# EAGLE design pedal-v1.0 (EAGLE 8.0.0)
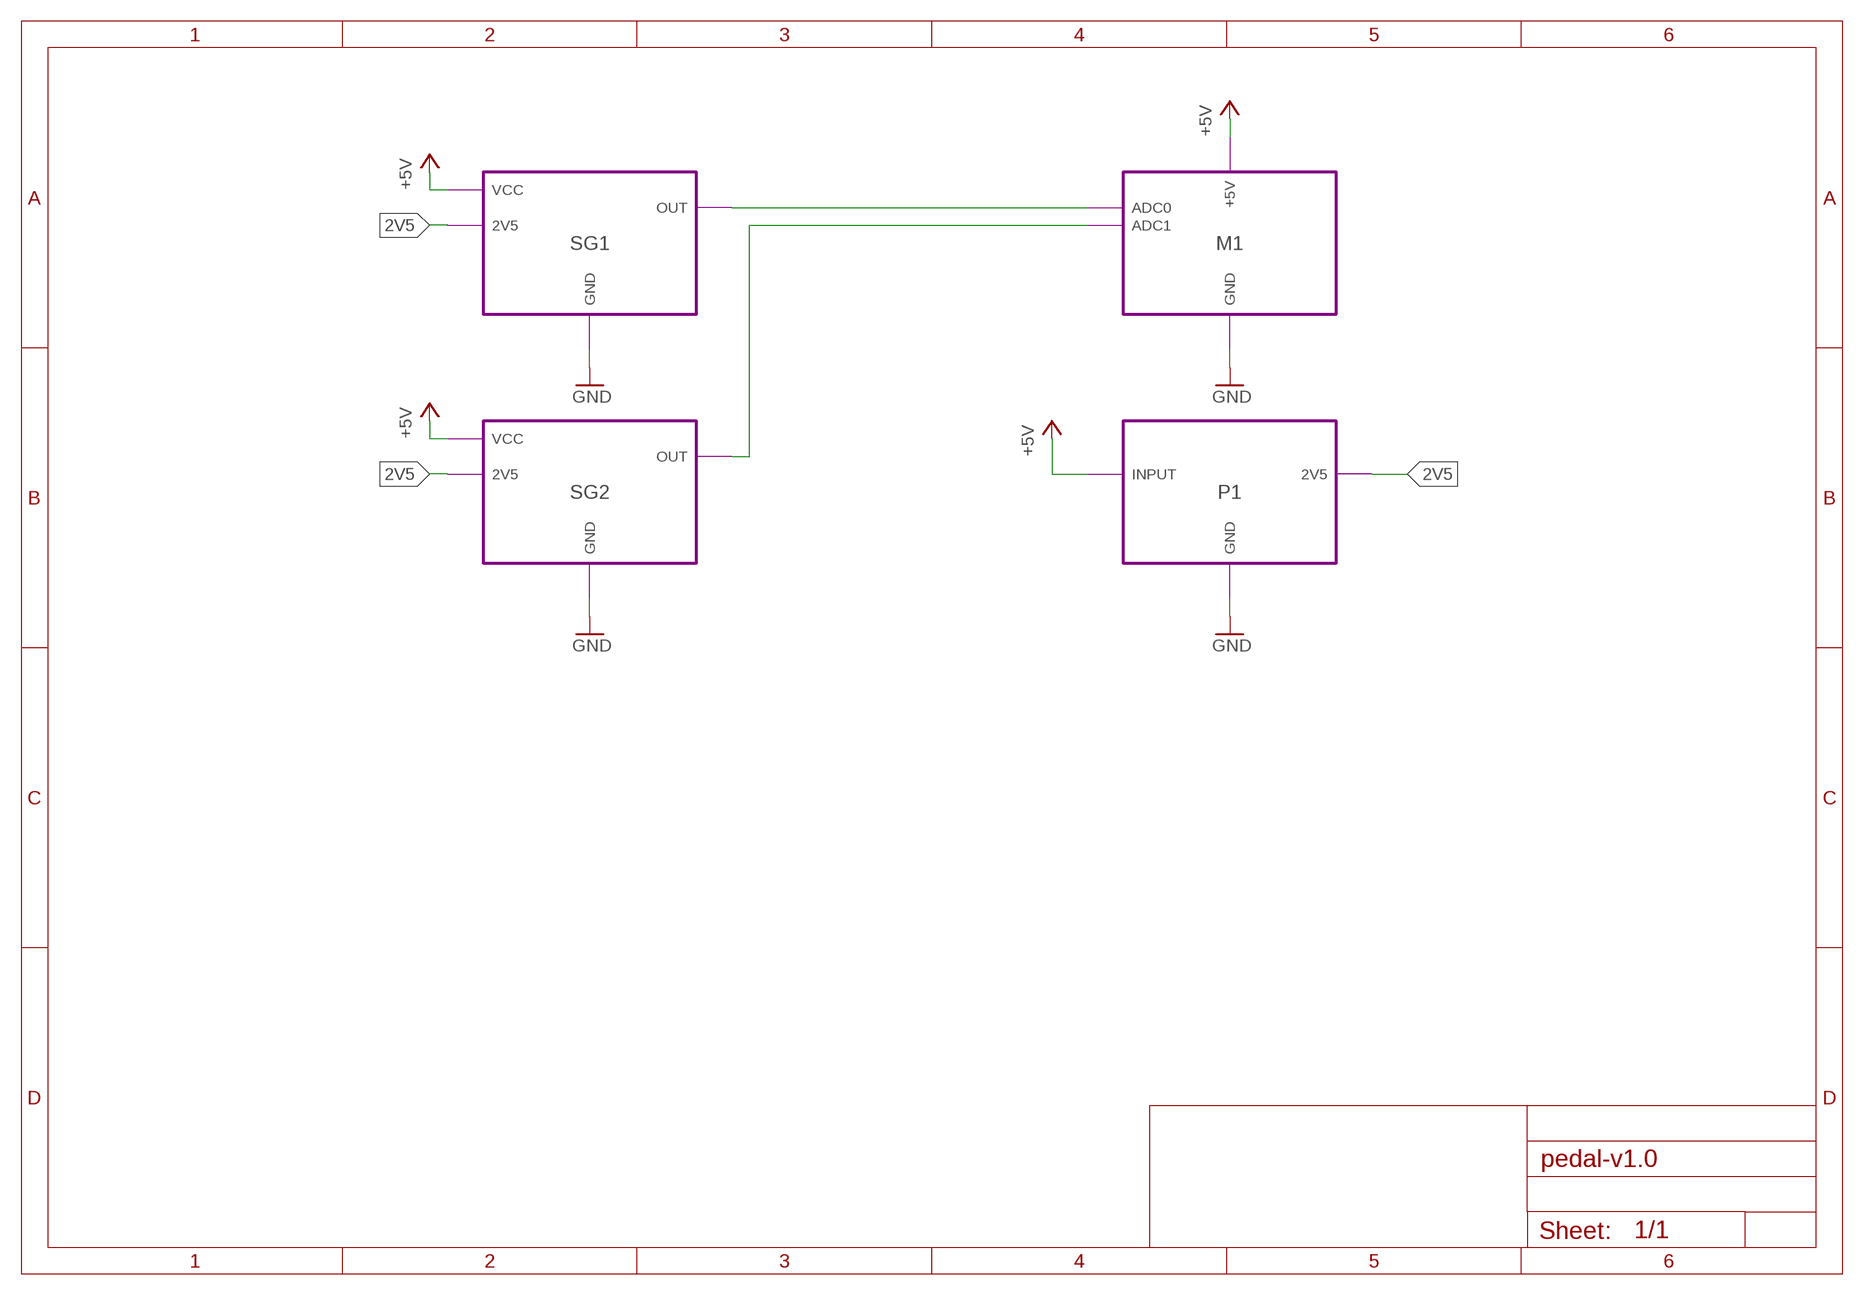
[diagram p0: schematic, sheet 1]

## Module instances
SG1 = STRAINGAUGE
SG2 = STRAINGAUGE
M1 = MCU
P1 = POWER

## Nets
2V5: port P1.2V5 SG1.2V5 SG2.2V5
+5V: port P1.INPUT M1.+5V SG1.VCC SG2.VCC
GND: port M1.GND P1.GND SG2.GND SG1.GND
N$1: port SG1.OUT M1.ADC0
N$2: port SG2.OUT M1.ADC1

## Library data of the parts

## Module STRAINGAUGE
Ports: OUT(io) 2V5(io) GND(io) VCC(io)
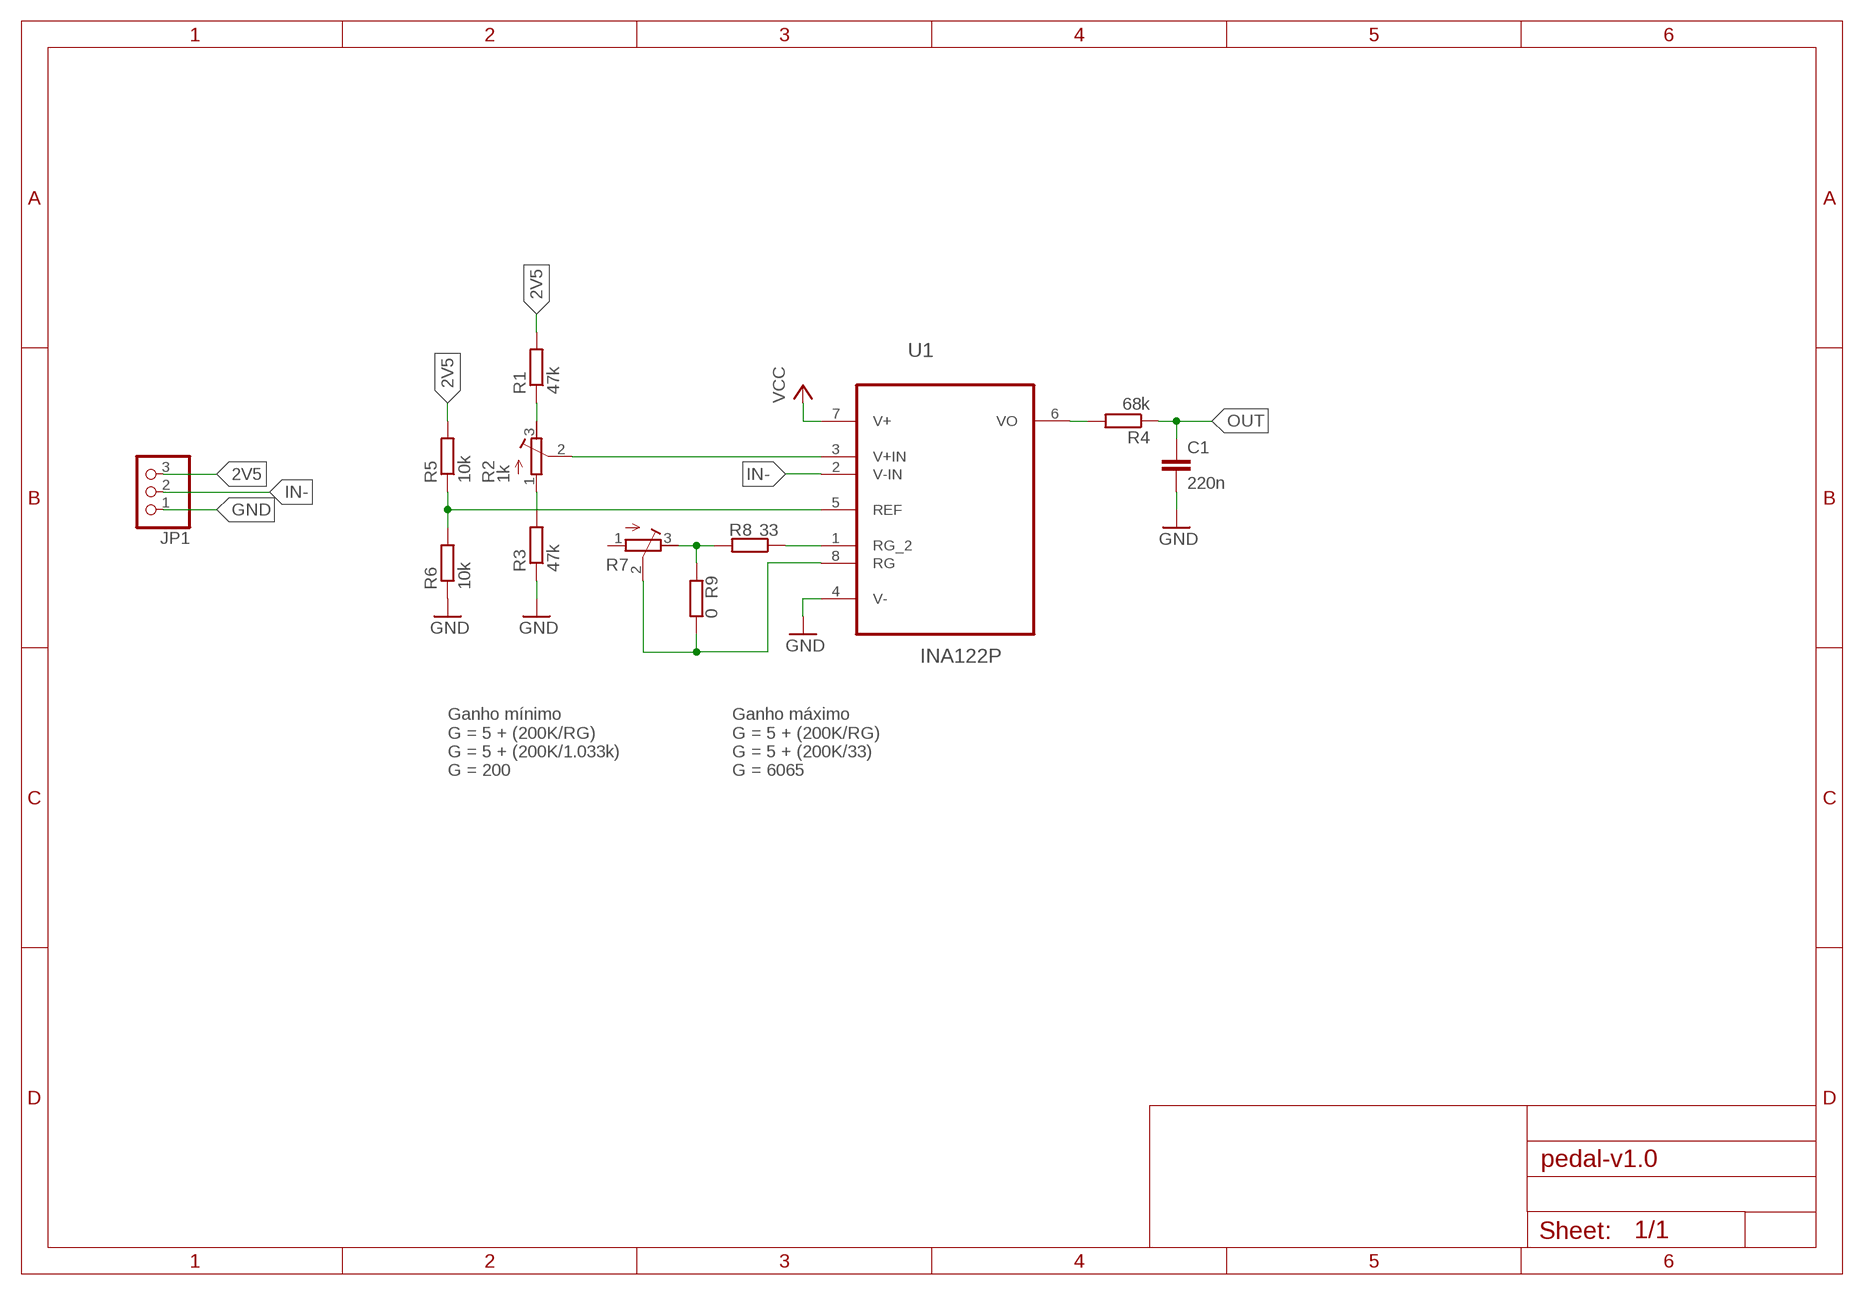
[diagram p1: schematic, module STRAINGAUGE, sheet 1]

### Parts
C1  220n  CPTH  [C050-030X075]
JP1  PINHD-1X3/90  [1X03/90]
R1  47k  RPTH  [0207/7]
R2  1k  R-TRIMM64W  [RTRIM64W]
R3  47k  RPTH  [0207/7]
R4  68k  RPTH  [0207/7]
R5  10k  RPTH  [0207/7]
R6  10k  RPTH  [0207/7]
R7  R-TRIMM64W  [RTRIM64W]
R8  33  RPTH  [0207/7]
R9  0  RPTH  [0207/7]
U1  INA122P  [DIP254P762X508-8]

### Nets
2V5: JP1.3 R1.2 R5.2
GND: C1.2 JP1.1 R3.1 R6.1 U1.4(V-)
IN-: JP1.2 U1.2(V-IN)
N$1: R1.1 R2.3(E)
N$2: R2.1(A) R3.2
N$3: R4.2 U1.6(VO)
N$5: R2.2(S) U1.3(V+IN)
N$6: R5.1 R6.2 U1.5(REF)
N$7: R8.1 U1.1(RG_2)
N$8: R7.3(E) R8.2 R9.2
N$9: R7.2(S) R9.1 U1.8(RG)
OUT: C1.1 R4.1
VCC: U1.7(V+)
Unconnected: R7.1(A)

### Notes on the sheet
- Ganho mínimo
  G = 5 + (200K/RG)
  G = 5 + (200K/1.033k)
  G = 200
- Ganho máximo
  G = 5 + (200K/RG)
  G = 5 + (200K/33)
  G = 6065

### Library data of the parts
C1 = lpra:C: Capacitors
JP1 = pinhead:PINHD-1X3: PIN HEADER
R1 R3-R6 R8 R9 = lpra:R
R2 R7 = rcl:R-TRIMM: Trimm resistor
U1 = lpra:INA122P: INSTRUMENTATION AMPLIFIER; MPN: INA122P; OC_FARNELL: 1459460; OC_NEWARK: 15M0948; PACKAGE: PDIP; SUPPLIER: Texas Instruments

## Module MCU
Ports: ADC0(io) ADC1(io) GND(io) +5V(io)
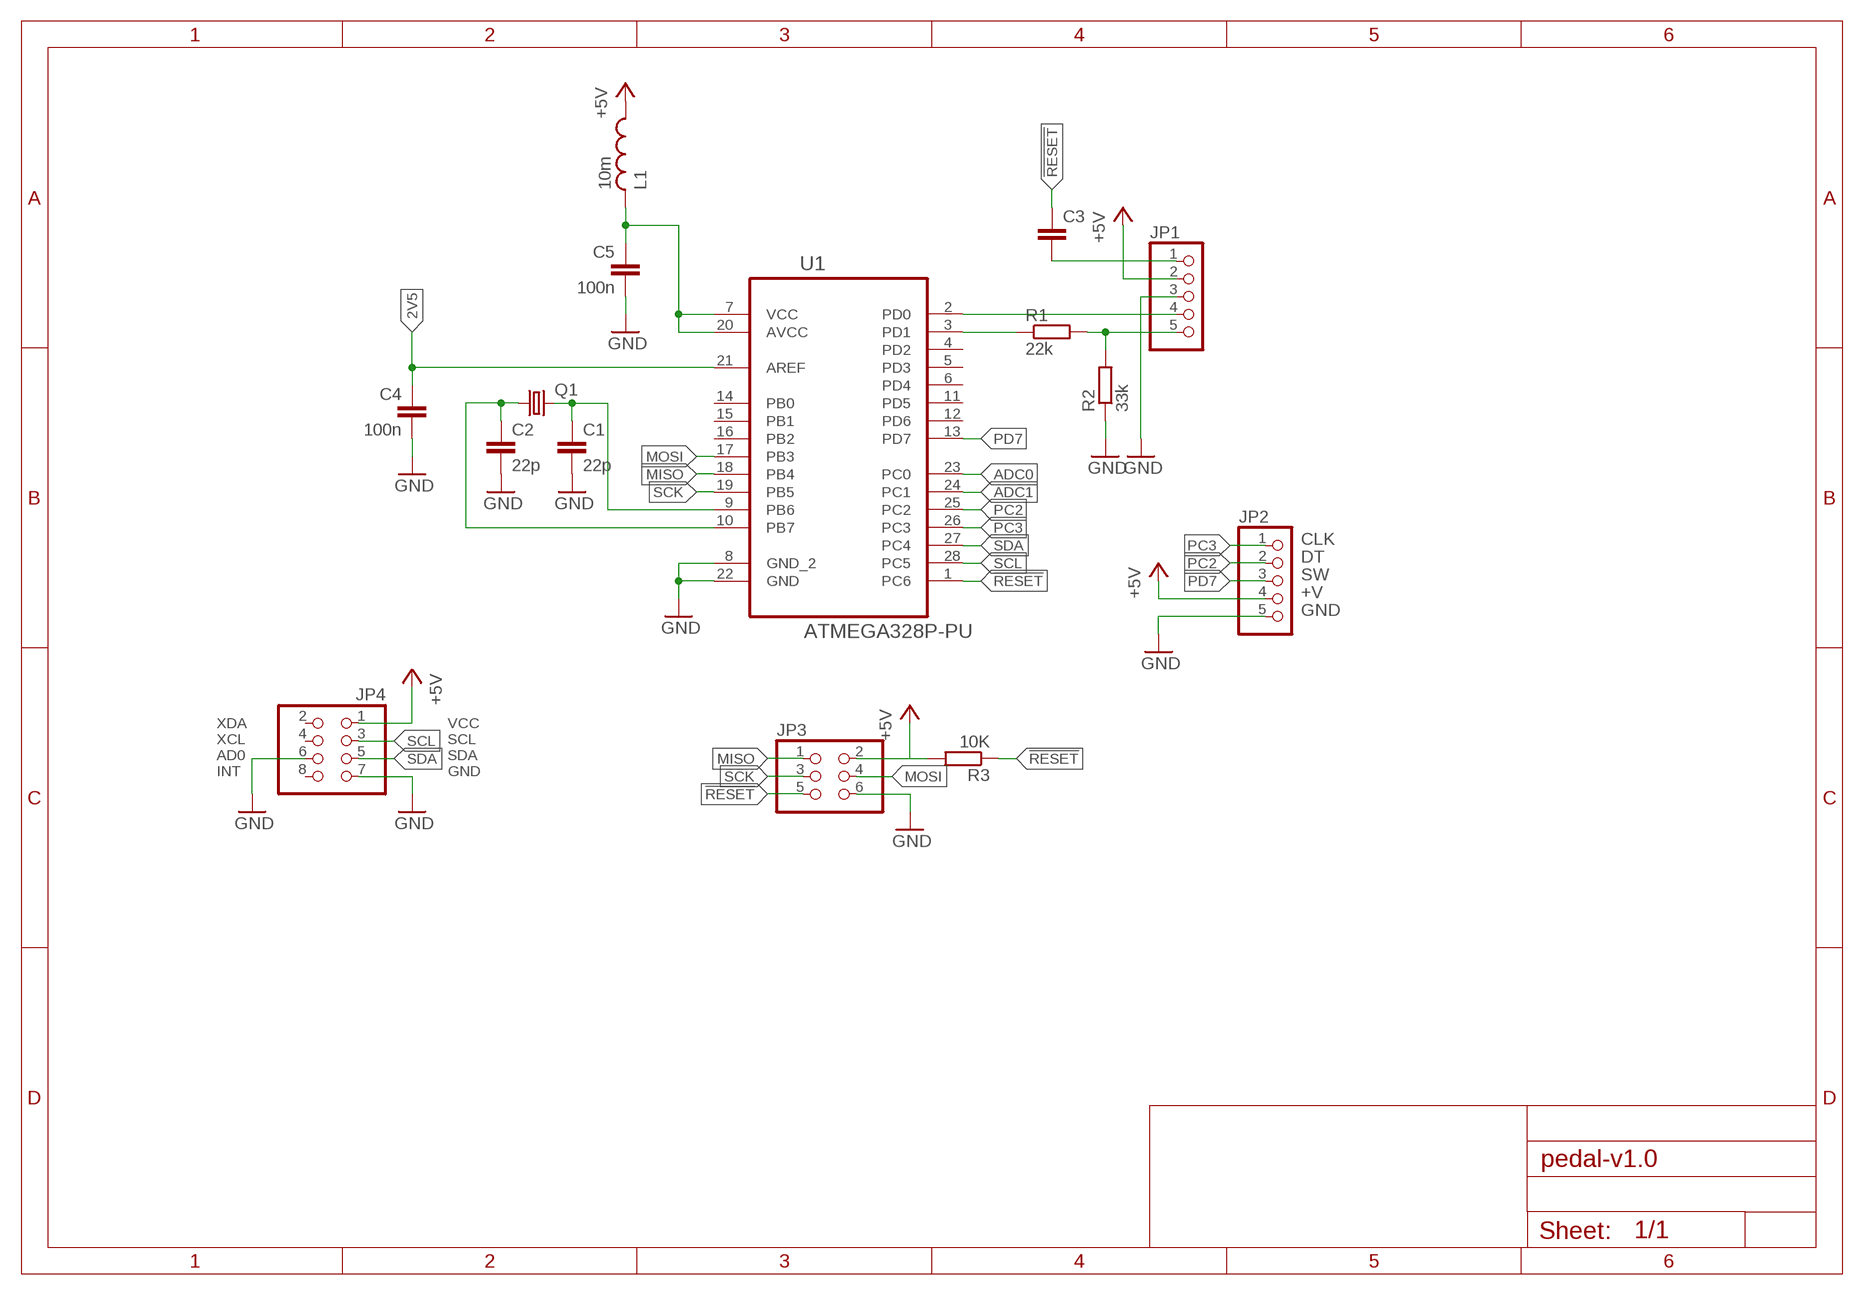
[diagram p2: schematic, module MCU, sheet 1]

### Parts
C1  22p  CPTH  [C050-030X075]
C2  22p  CPTH  [C050-030X075]
C3  CPTH  [C050-030X075]
C4  100n  CPTH  [C050-030X075]
C5  100n  CPTH  [C050-030X075]
JP1  PINHD-1X5  [1X05]
JP2  PINHD-1X5  [1X05]
JP3  PINHD-2X3  [2X03]
JP4  PINHD-2X4  [2X04]
L1  10m  L-US0207/7  [0207/7]
Q1  CRYSTALHC49S  [HC49/S]
R1  22k  RPTH  [0207/7]
R2  33k  RPTH  [0207/7]
R3  10K  RPTH  [0207/7]
U1  ATMEGA328P-PU  [DIP254P762X457-28]

### Nets
2V5: C4.1 U1.21(AREF)
!RESET: C3.1 JP3.5 R3.1 U1.1(PC6)
+5V: JP1.2 JP2.4 JP3.2 JP4.1 L1.1 R3.2
ADC0: U1.23(PC0)
ADC1: U1.24(PC1)
GND: C1.2 C2.2 C4.2 C5.2 JP1.3 JP2.5 JP3.6 JP4.6 JP4.7 R2.1 U1.8(GND_2) U1.22(GND)
MISO: JP3.1 U1.18(PB4)
MOSI: JP3.4 U1.17(PB3)
N$1: JP1.5 R1.2 R2.2
N$2: JP1.4 U1.2(PD0)
N$3: C1.1 Q1.2 U1.9(PB6)
N$4: C2.1 Q1.1 U1.10(PB7)
N$5: R1.1 U1.3(PD1)
N$6: C3.2 JP1.1
N$7: C5.1 L1.2 U1.7(VCC) U1.20(AVCC)
PC2: JP2.2 U1.25(PC2)
PC3: JP2.1 U1.26(PC3)
PD7: JP2.3 U1.13(PD7)
SCK: JP3.3 U1.19(PB5)
SCL: JP4.3 U1.28(PC5)
SDA: JP4.5 U1.27(PC4)
Unconnected: JP4.2 JP4.4 JP4.8 U1.4(PD2) U1.5(PD3) U1.6(PD4) U1.11(PD5) U1.12(PD6) U1.14(PB0) U1.15(PB1) U1.16(PB2)

### Notes on the sheet
- CLK
- DT
- SW
- +V
- GND
- XDA
  XCL
  AD0
  INT
- VCC
  SCL
  SDA
  GND

### Library data of the parts
C1-C5 = lpra:C: Capacitors
JP1 JP2 = pinhead:PINHD-1X5: PIN HEADER
JP3 = pinhead:PINHD-2X3: PIN HEADER
JP4 = pinhead:PINHD-2X4: PIN HEADER
L1 = rcl:L-US: INDUCTOR, American symbol
Q1 = crystal:CRYSTAL: CRYSTAL; OC_FARNELL: 1667008; OC_NEWARK: unknown
R1-R3 = lpra:R
U1 = Atmel_By_element14_Batch_1-00:ATMEGA328P-PU: 8-bit Microcontroller with In-System Programmable Flash; MPN: ATMEGA328P-PU; OC_FARNELL: 1715487; OC_NEWARK: 15R0268; PACKAGE: PDIP-28; SUPPLIER: Atmel

## Module POWER
Ports: GND(io) INPUT(io) 2V5(io)
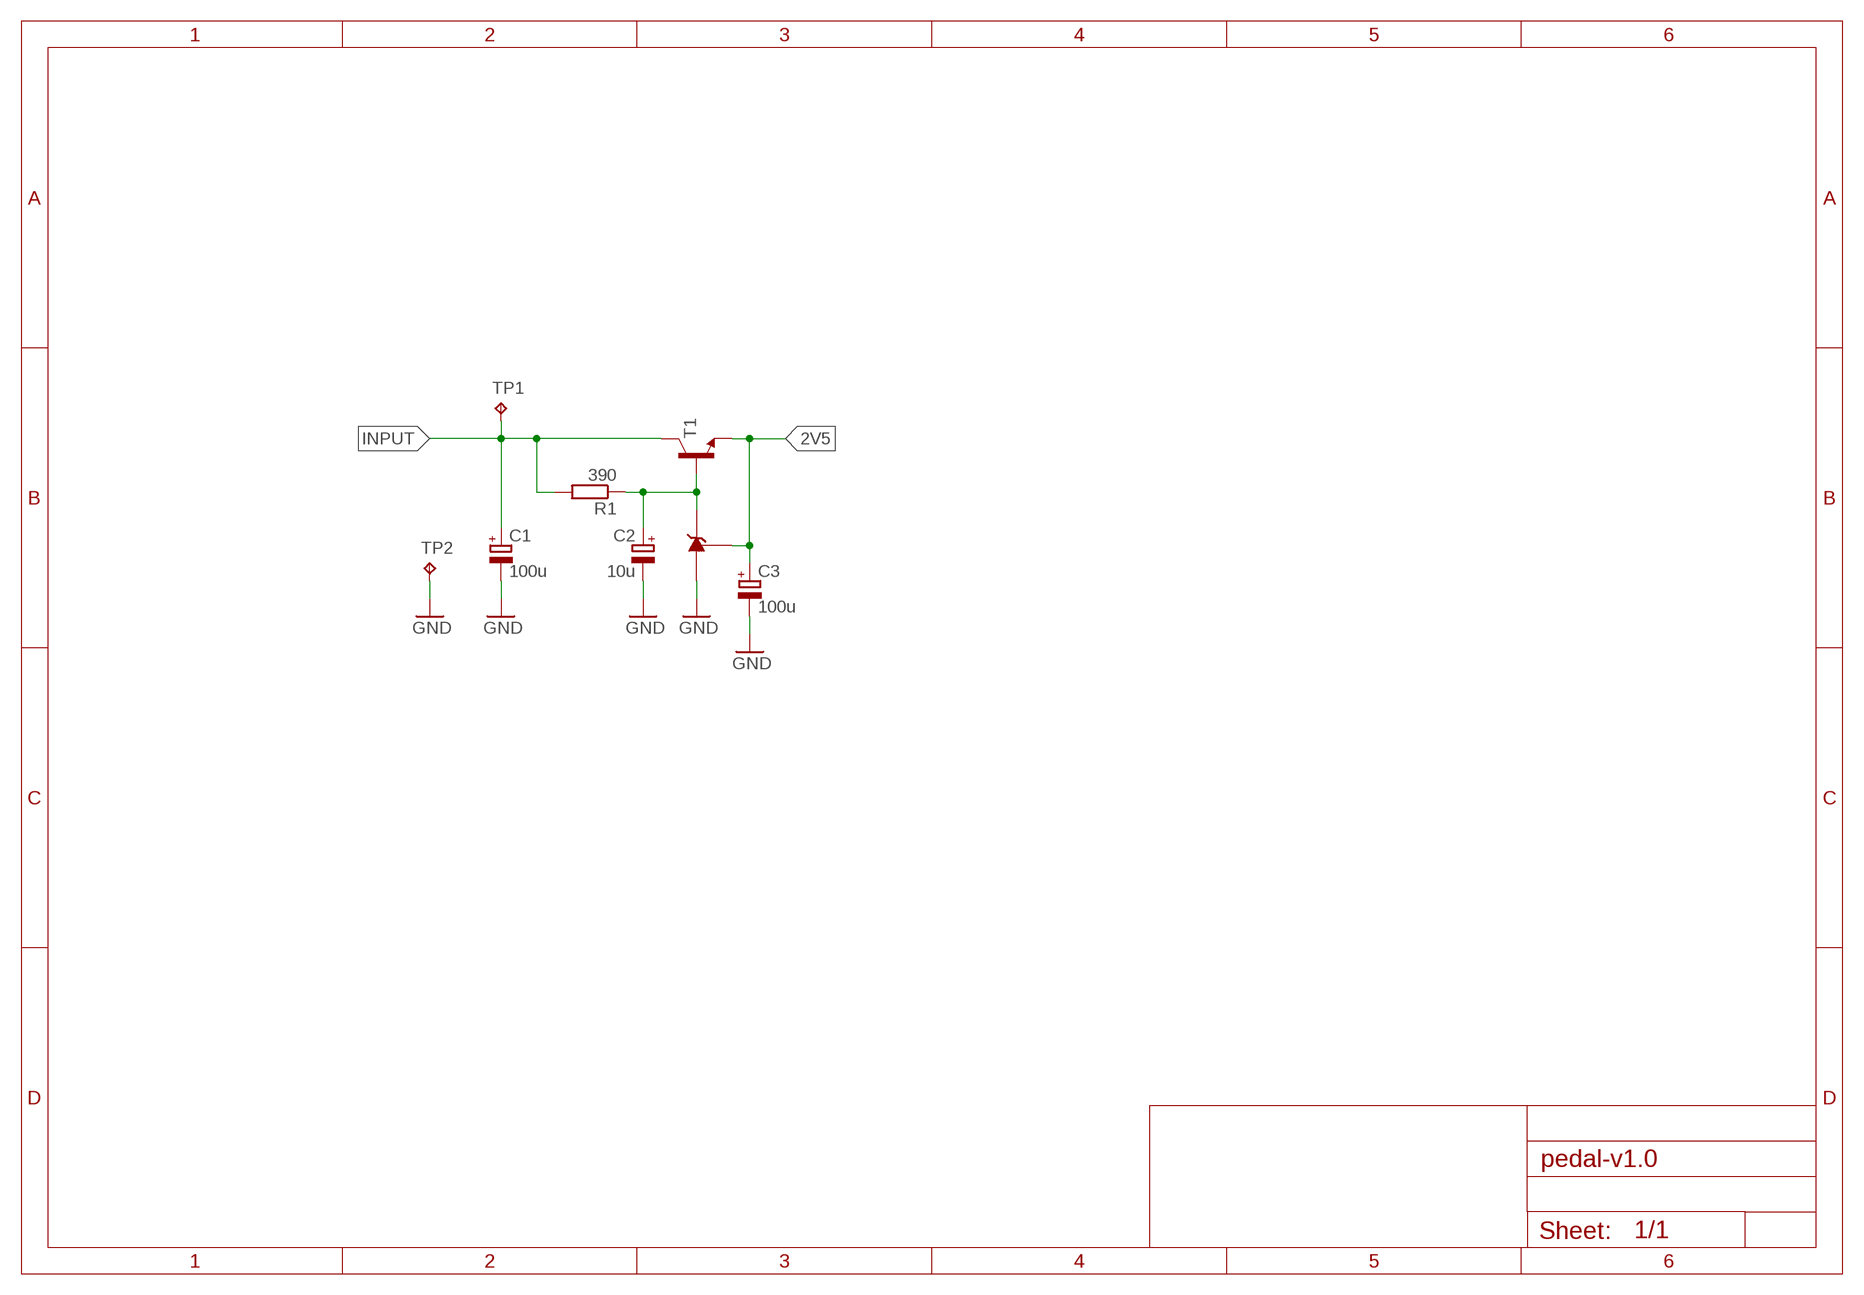
[diagram p3: schematic, module POWER, sheet 1]

### Parts
C1  100u  CPOL-EUE3.5-8  [E3,5-8]
C2  10u  CPOL-EUE2.5-5  [E2,5-5]
C3  100u  CPOL-EUE3.5-8  [E3,5-8]
R1  390  RPTH  [0207/7]
T1  bc548  BC548C  [TO92]
TP1  TPPAD1-17  [P1-17]
TP2  TPPAD1-17  [P1-17]
U$1  TL431LP  [TO92]

### Nets
2V5: C3.+ T1.3(E) U$1.1(R)
GND: C1.- C2.- C3.- TP2.TP U$1.2(A)
INPUT: C1.+ R1.2 T1.1(C) TP1.TP
N$1: C2.+ R1.1 T1.2(B) U$1.3(K)

### Library data of the parts
C1-C3 = rcl:CPOL-EU: POLARIZED CAPACITOR, European symbol
R1 = lpra:R
T1 = lpra:BC548C
TP1 TP2 = testpad:TP: Test pad
U$1 = lpra:TL431LP

## Net classes
0 SIGNAL: width 0.356 mm

## Board
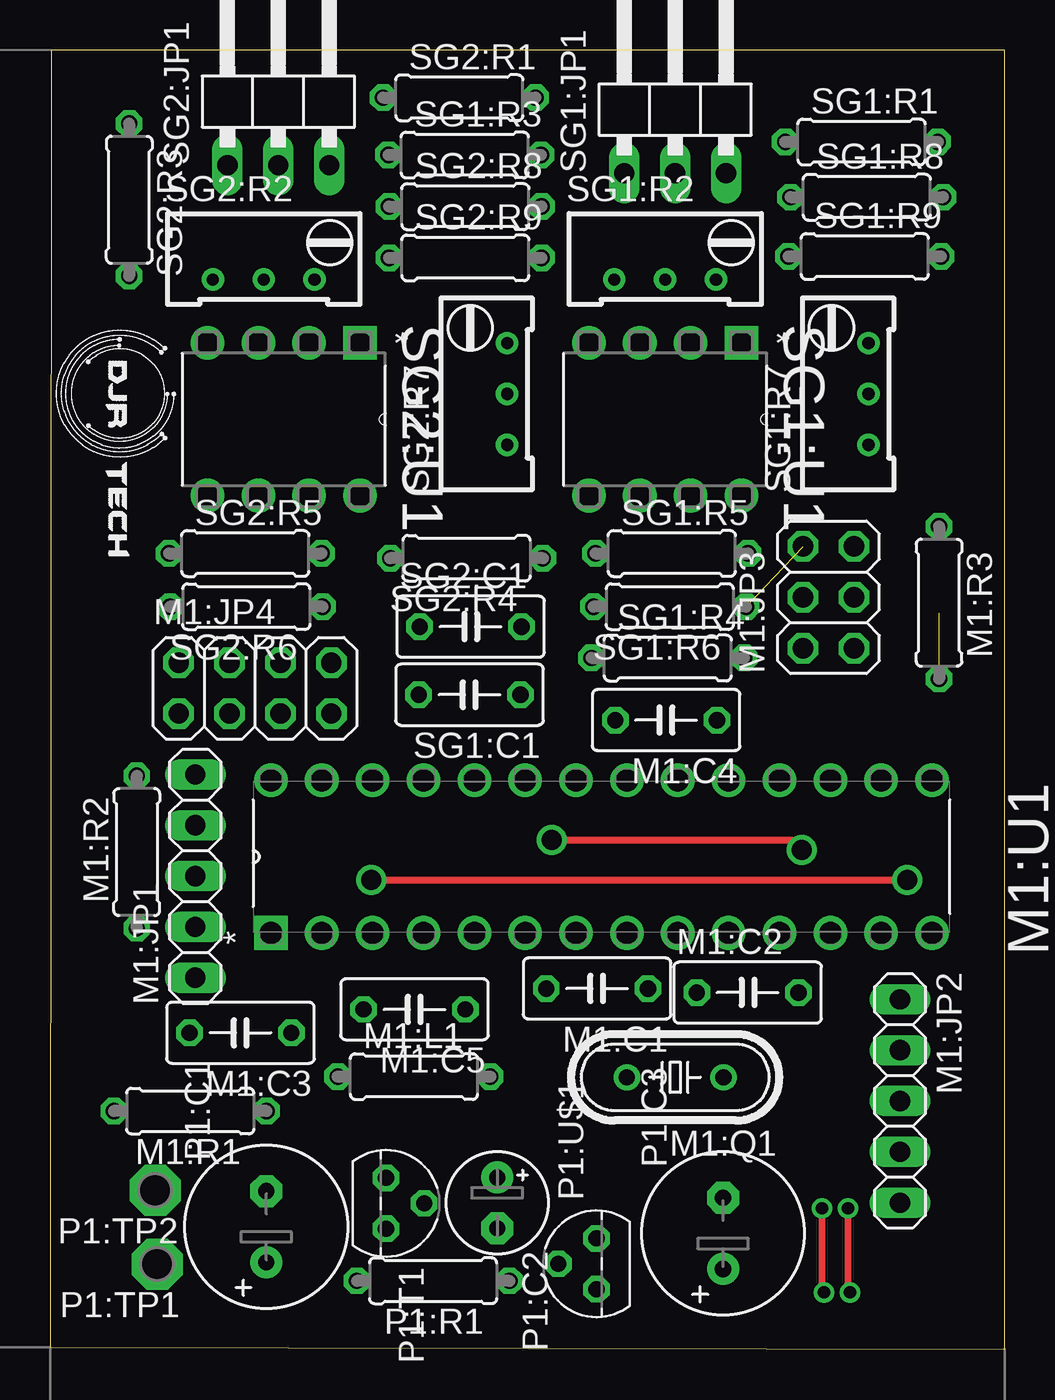
[diagram p4: board, top side]
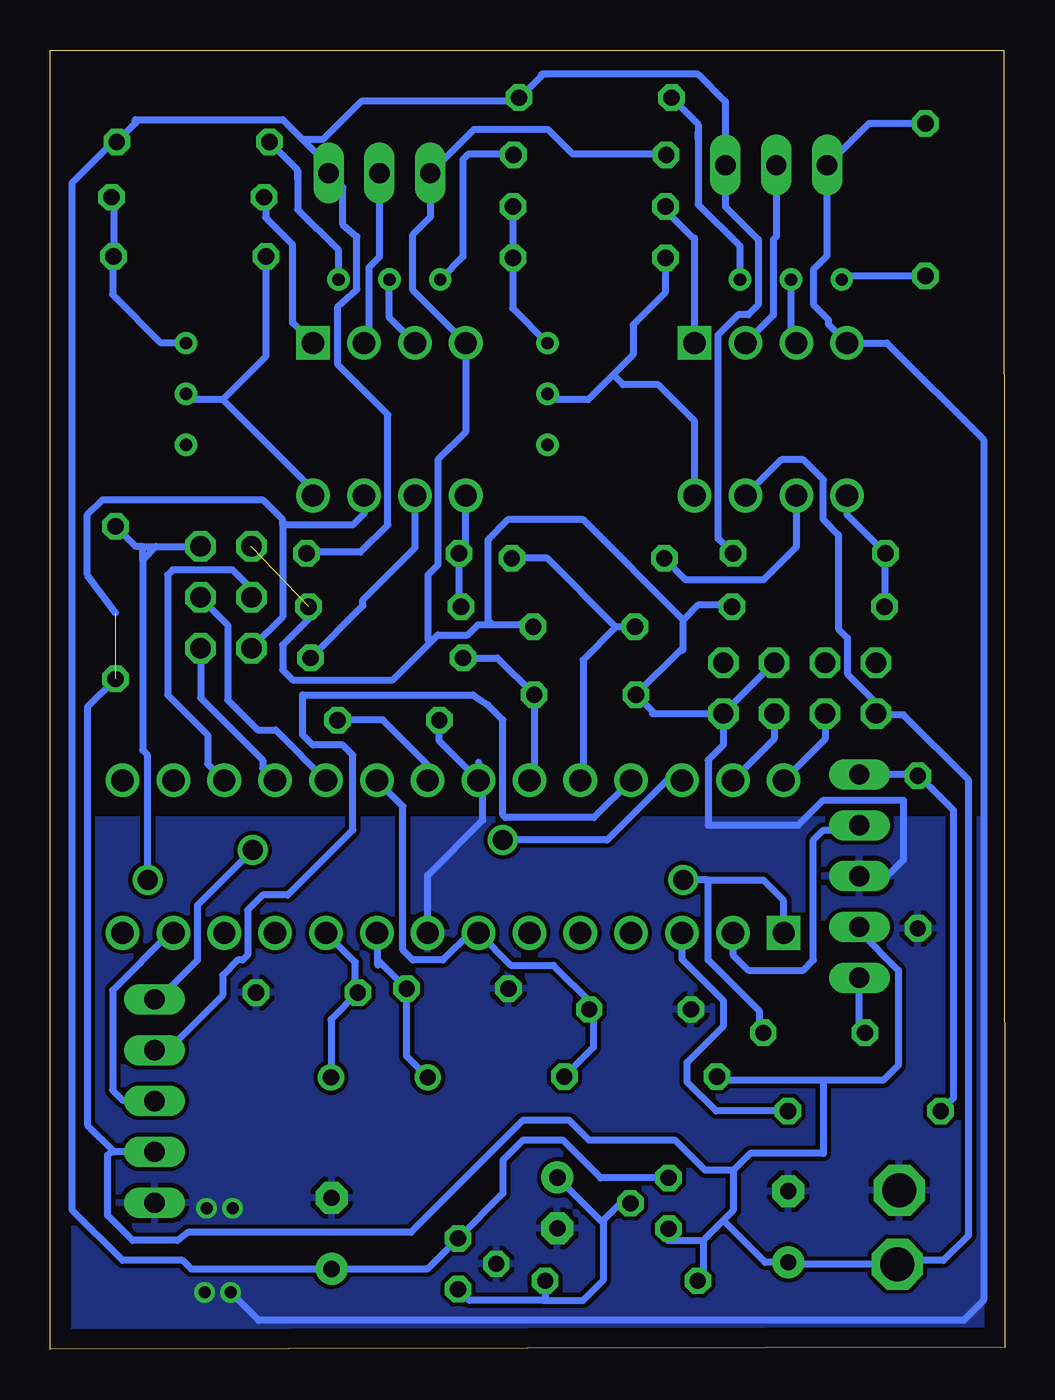
[diagram p5: board, bottom side, seen from below]

Size 47.67 x 64.92 mm. Coordinates in mm from the lower left corner, seen from the top.
Outline: 0,0.1 47.67,0 47.67,64.92 0.05,64.92 0,0.1
Copper layers (1*16): Top 0.035mm / dielectric 1.5mm / Bottom 0.035mm
Design rules "default": minimum track width 10mil, minimum drill 24mil, track to track 8mil, track to pad 8mil, pad to pad 8mil, via to via 8mil, smd to smd 8mil, copper to edge 40mil, drill to drill 8mil, minimum pad ring 10mil, minimum via ring 8mil, stop-mask expansion 4mil, vias tented up to drill 0mil, thermal gap 10mil

### Footprints (pad centres in the part's own frame; a part is rotated, then mirrored left to right if it is on the bottom)
C050-030X075 = drill 0.813 octagon: 1 -2.54,0; 2 2.54,0
1X05 = drill 1.016 long: 1 -5.08,0; 2 -2.54,0; 3 0,0; 4 2.54,0; 5 5.08,0
2X03 = drill 1.016 octagon: 1 -2.54,-1.27; 2 -2.54,1.27; 3 0,-1.27; 4 0,1.27; 5 2.54,-1.27; 6 2.54,1.27
2X04 = drill 1.016 octagon: 1 -3.81,-1.27; 2 -3.81,1.27; 3 -1.27,-1.27; 4 -1.27,1.27; 5 1.27,-1.27; 6 1.27,1.27; 7 3.81,-1.27; 8 3.81,1.27
0207/7 = drill 0.813 octagon: 1 -3.81,0; 2 3.81,0
HC49/S = drill 0.813: 1 -2.413,0; 2 2.413,0
DIP254P762X457-28 = drill 1.118 square: 1 -7.62,33.02 | drill 1.118: 2 -7.62,30.48; 3 -7.62,27.94; 4 -7.62,25.4; 5 -7.62,22.86; 6 -7.62,20.32; 7 -7.62,17.78; 8 -7.62,15.24; 9 -7.62,12.7; 10 -7.62,10.16; 11 -7.62,7.62; 12 -7.62,5.08; 13 -7.62,2.54; 14 -7.62,0; 15 0,0; 16 0,2.54; 17 0,5.08; 18 0,7.62; 19 0,10.16; 20 0,12.7; 21 0,15.24; 22 0,17.78; 23 0,20.32; 24 0,22.86; 25 0,25.4; 26 0,27.94; 27 0,30.48; 28 0,33.02
E3,5-8 = drill 0.813 pad 1.6: + -1.778,0 | drill 0.813 pad 1.6 octagon: - 1.778,0
E2,5-5 = drill 0.813 pad 1.6: + -1.27,0 | drill 0.813 pad 1.6 octagon: - 1.27,0
TO92 = drill 0.813 octagon: 1 1.27,0; 2 0,1.905; 3 -1.27,0
P1-17 = drill 1.702 pad 2.54 octagon: TP 0,0
1X03/90 = drill 1.016 long: 1 -2.54,-3.81; 2 0,-3.81; 3 2.54,-3.81
RTRIM64W = drill 0.61: 1 1.27,-2.54; 2 1.27,0; 3 1.27,2.54
DIP254P762X508-8 = drill 1.118 square: 1 -7.62,7.62 | drill 1.118: 2 -7.62,5.08; 3 -7.62,2.54; 4 -7.62,0; 5 0,0; 6 0,2.54; 7 0,5.08; 8 0,7.62

### Placement (x,y rotation side)
M1:C1  22p  [C050-030X075]  27.32,18.03 180 top
M1:C2  22p  [C050-030X075]  34.84,17.83 0 top
M1:C3  [C050-030X075]  9.51,15.82 180 top
M1:C4  100n  [C050-030X075]  30.77,31.44 180 top
M1:C5  100n  [C050-030X075]  18.2,16.99 180 top
M1:JP1  [1X05]  7.25,23.65 90 top
M1:JP2  [1X05]  42.45,12.41 270 top
M1:JP3  [2X03]  38.88,37.58 90 top
M1:JP4  [2X04]  10.23,33.04 0 top
M1:L1  10m  [0207/7]  18.18,13.63 0 top
M1:Q1  [HC49/S]  31.22,13.59 180 top
M1:R1  22k  [0207/7]  7,11.91 180 top
M1:R2  33k  [0207/7]  4.33,24.85 90 top
M1:R3  10K  [0207/7]  44.4,37.31 270 top
M1:U1  ATMEGA328P-PU  [DIP254P762X457-28]  44.05,28.43 90 top
P1:C1  100u  [E3,5-8]  10.8,6.13 90 top
P1:C2  10u  [E2,5-5]  22.33,7.32 270 top
P1:C3  100u  [E3,5-8]  33.61,5.8 90 top
P1:R1  390  [0207/7]  19.13,3.43 180 top
P1:T1  bc548  [TO92]  16.78,7.3 270 top
P1:TP1  TPPAD1-17  [P1-17]  5.35,4.26 180 top
P1:TP2  TPPAD1-17  [P1-17]  5.25,7.95 180 top
P1:U$1  TL431LP  [TO92]  27.29,4.28 90 top
SG1:C1  220n  [C050-030X075]  20.95,32.71 180 top
SG1:JP1  [1X03/90]  31.22,62.58 0 top
SG1:R1  47k  [0207/7]  40.52,60.33 0 top
SG1:R2  1k  [RTRIM64W]  30.72,54.72 270 top
SG1:R3  47k  [0207/7]  20.71,59.68 0 top
SG1:R4  68k  [0207/7]  30.85,34.55 0 top
SG1:R5  10k  [0207/7]  31.05,39.77 0 top
SG1:R6  10k  [0207/7]  30.95,37.11 180 top
SG1:R7  [RTRIM64W]  39.61,47.74 0 top
SG1:R8  33  [0207/7]  40.79,57.57 0 top
SG1:R9  0  [0207/7]  40.69,54.61 0 top
SG1:U1  INA122P  [DIP254P762X508-8]  26.91,42.66 270 top
SG2:C1  220n  [C050-030X075]  21,36.11 0 top
SG2:JP1  [1X03/90]  11.4,62.98 0 top
SG2:R1  47k  [0207/7]  20.44,62.54 0 top
SG2:R2  1k  [RTRIM64W]  10.67,54.72 270 top
SG2:R3  47k  [0207/7]  3.95,57.44 270 top
SG2:R4  68k  [0207/7]  20.8,39.53 180 top
SG2:R5  10k  [0207/7]  9.75,39.77 0 top
SG2:R6  10k  [0207/7]  9.8,37.11 180 top
SG2:R7  [RTRIM64W]  21.56,47.74 0 top
SG2:R8  33  [0207/7]  20.74,57.1 0 top
SG2:R9  0  [0207/7]  20.74,54.54 0 top
SG2:U1  INA122P  [DIP254P762X508-8]  7.86,42.66 270 top
U$1  [LOGO]  0.15,51.05 270 top

### Tracks (layer width: path | path; a pad name or v marks a point on that pad's centre or on a via)
2V5
  Bottom 0.356: 35.05,60.45 33.76,59.16 SG1:JP1.3 33.05,58.06 33.05,56.2 32.35,55.6 32.35,52.95 33.3,52.1 33.3,49.2 30.8,46.7 30.8,41.2 32.17,39.83 34.8,39.83 SG1:R5.2 | 35.05,60.45 36.05,61.45 43.4,61.45 43.4,61.26 SG1:R1.2 44.52,60.33 46.55,58.3 46.55,6.95 44.05,4.45 41.05,4.45 40.62,4.02 P1:C3.+ 28.82,4.02 P1:U$1.1 25.05,7.79 25.05,9.45 24.05,10.45 22.05,10.45 20.17,8.57 P1:T1.3 | 35.05,60.45 34.05,60.45 32.14,62.36 24.43,62.36 SG2:R1.2 24.21,62.54 23.05,63.7 | 23.05,63.7 15.3,63.7 13.94,62.34 SG2:JP1.3 13.94,57.09 12.3,55.45 12.3,52.2 12.8,51.7 13.3,51.7 14.3,50.7 14.3,40.51 SG2:R5.2 | 23.05,63.7 23.13,63.7
+5V  (1 unrouted)
  Bottom 0.356: 16.78,5.45 16.8,5.45 | 16.78,5.45 15.05,5.45 | 44.4,36.8 45.8,38.7 45.8,41.7 45.05,42.45 37.05,42.45 36.05,41.45 36.05,41.2 | 36.05,41.2 36.05,36.6 M1:JP3.2 | M1:JP1.2 7.25,20.91 5.3,18.95 5.3,14.2 6.05,13.45 9.05,13.45 | 9.05,13.45 14.18,13.45 M1:L1.1 | SG1:U1.7 31.99,41.76 32.55,41.2 36.05,41.2 | 9.05,13.45 9.05,9.8 12.7,9.8 13.55,8.95 | SG2:U1.7 11.15,44.45 10.05,44.45 9.05,43.45 9.05,41.45 8.3,40.7 8.3,36 7.85,35.55 7.85,33.75 6.42,32.33 M1:JP4.1 6.36,31.7 5.05,31.7 1.8,28.45 1.8,5.7 3.05,4.45 5.16,4.45 P1:TP1.TP 10.71,4.26 P1:C1.+ 11.95,4.35 14.05,6.45 | 44.55,9.95 44.8,9.7 44.8,6.7 43.55,5.45 41.3,5.45 40.8,5.85 29.65,5.85 24.05,11.45 21.75,11.45 20.75,10.45 16.45,10.45 14.95,8.95 13.55,8.95 | M1:JP2.4 44.47,9.87 44.55,9.95 | 44.55,9.95 45.8,11.2 45.8,32.1 M1:R3.2 | 13.55,8.95 13.55,6.95 14.05,6.45 | 14.05,6.45 15.05,5.45 | 15.05,5.45 15.05,3.7 P1:R1.2 | P1:T1.1 16.78,5.45
GND  (via drill 0.61)  (1 unrouted)
  Top 0.356: v38.55,7.05 38.55,2.95 v38.65,2.85 | v39.85,7.05 39.85,2.95 v39.95,2.85
  Bottom 0.356: 26.27,29.34 M1:U1.22 | M1:U1.8 28.81,23.69 26.05,26.45 26.05,28.21 M1:U1.22 | M1:JP4.6 M1:JP4.7 | M1:JP1.3 5.85,23.65 5.05,24.45 5.05,27.45 9.05,27.45 10.3,26.2 14.8,26.2 14.8,29.45 14.04,30.2 M1:JP4.7 | SG1:U1.4 29.55,52.92 29.55,55.7 28.68,56.57 SG1:JP1.1 26.5,60.95 22.8,60.95 21.57,59.72 16.94,59.72 SG1:R3.1 | SG1:U1.4 27.22,50.28 | M1:JP4.7 17.59,31.77 17.59,31.89 SG1:C1.2 16.17,34.95 16.05,34.95 16.05,36.45 | 16.05,36.45 15.31,37.19 13.69,37.19 SG2:R6.1 | 16.05,36.45 21.05,41.45 24.8,41.45 25.8,40.45 25.8,36.45 25.55,36.2 | 25.55,36.2 26.3,36.2 26.8,35.7 28.3,35.7 28.68,35.33 | 28.68,35.33 30.55,33.45 35.55,33.45 36.05,33.95 36.05,35.2 34.76,36.49 SG1:R6.1 | SG1:U1.4 26.91,45.84 28.3,44.45 28.3,39.2 28.8,38.7 28.8,35.45 28.68,35.33 | v38.65,2.85 37.25,1.45 2.05,1.45 1.05,2.45 1.05,45.45 5.88,50.28 SG2:U1.4 8.8,51.22 8.8,51.45 9.55,52.2 9.55,53.95 8.86,54.64 SG2:JP1.1 6.78,61.25 SG2:R3.1 | M1:U1.22 28.23,30.39 M1:C4.2 | SG2:C1.2 23.63,36.2 25.55,36.2
  pour Bottom: 1.05,26.45 46.8,26.45 46.8,0.2 1.05,0.2
M1:2V5
  Bottom 0.356: M1:U1.21 28.81,29.21 31.05,31.45 31.06,31.44 M1:C4.1
M1:!RESET  (via drill 1)
  Top 0.356: v16.05,23.45 v42.8,23.45
  Bottom 0.356: 43.05,40.12 M1:JP3.5 | 43.05,40.12 43.4,40.12 M1:R3.1 | 42.38,40.12 43.05,39.45 | 43.05,39.45 43.05,29.95 42.8,29.7 v42.8,23.45 | M1:U1.1 11.03,22.43 12.05,23.45 14.8,23.45 | 14.8,23.45 v16.05,23.45 | 14.8,23.45 14.8,19.45 12.23,16.88 12.23,16 M1:C3.1 | 43.05,39.45 43.05,40.12
M1:MISO
  Bottom 0.356: M1:JP3.1 40.15,32.55 37.05,29.45 37.05,29.05 M1:U1.18
M1:MOSI
  Bottom 0.356: M1:JP3.4 37.61,38.01 38.55,38.95 41.55,38.95 41.8,38.7 41.8,32.7 39.8,30.7 39.8,29.26 M1:U1.17
M1:N$1
  Bottom 0.356: M1:JP1.5 4.4,28.73 M1:R2.2 4.26,28.66 2.55,26.95 2.55,12.55 M1:R1.2
M1:N$2
  Bottom 0.356: M1:U1.2 13.57,19.72 12.8,18.95 10.05,18.95 9.55,19.45 9.55,25.45 9.05,25.95 7.49,25.95 M1:JP1.4
M1:N$3
  Bottom 0.356: 31.3,19.2 31.3,19.45 | 31.3,19.45 31.3,20.76 M1:U1.9 | 29.22,14.01 M1:Q1.2 29.86,14.65 M1:C1.1 29.88,18.03 31.3,19.45
M1:N$4
  Bottom 0.356: M1:Q1.1 33.63,16.46 33.63,16.5 M1:C2.1 32.42,17.95 32.42,19.34 M1:U1.10
M1:N$5
  Bottom 0.356: M1:U1.3 16.11,19.51 14.05,17.45 14.05,16.15 15.85,14.35 15.85,13.35 14.41,11.91 M1:R1.1
M1:N$6
  Bottom 0.356: 7.15,18.46 M1:JP1.1 7.25,16.11 M1:C3.2
M1:N$7
  Bottom 0.356: M1:U1.20 30.05,27.13 30.05,19.95 29.55,19.45 28.05,19.45 26.69,20.81 M1:U1.7 24.66,19.2 22.53,19.2 20.54,17.21 20.54,16.45 | M1:L1.2 20.54,15.08 20.54,16.45 | M1:C5.1 20.54,16.79 20.54,16.45
M1:PC2
  Bottom 0.356: M1:JP2.2 41.8,14.95 39.05,17.7 39.05,18.7 38.3,19.45 38.05,19.45 37.8,19.7 37.8,21.95 37.05,22.7 35.8,22.7 32.55,25.95 32.55,29.7 33.05,30.2 34.55,30.2 35.05,30.7 35.05,32.7 26.55,32.7 25.8,32.2 25.05,31.45 25.05,26.7 24.93,26.57 20.5,26.57 M1:U1.25
M1:PC3  (via drill 1)
  Top 0.356: v25.05,25.45 37.05,25.45 v37.55,24.95
  Bottom 0.356: M1:U1.26 16.87,28.43 19.85,25.45 v25.05,25.45 | M1:JP2.1 42.26,17.49 40.3,19.45 40.3,22.2 v37.55,24.95 37.3,25.2
M1:PD7
  Bottom 0.356: M1:U1.13 41.69,20.81 44.55,17.95 44.55,12.95 44.05,12.45 42.49,12.45 M1:JP2.3
M1:SCK
  Bottom 0.356: M1:JP3.3 40.15,37.55 38.8,36.2 38.8,32.45 37.3,30.95 36.41,30.95 M1:U1.19
M1:SCL
  Bottom 0.356: M1:JP4.3 8.96,30.5 M1:U1.28
M1:SDA
  Bottom 0.356: M1:JP4.5 11.5,30.5 M1:U1.27
N$1
  Bottom 0.356: M1:U1.23 23.49,28.67 SG1:C1.1 25.33,34.55 SG1:R4.1
N$2
  Bottom 0.356: 19.41,36.09 21.05,34.45 21.05,28.57 M1:U1.24 | SG2:C1.1 18.48,36.09 19.41,36.09 | 19.41,36.09 22.85,39.53 SG2:R4.1
P1:N$1
  Bottom 0.356: 20.05,6.45 19.2,7.3 P1:T1.2 | 20.05,6.45 20.05,3.45 21.05,2.45 23.05,2.45 | 20.05,6.45 20.19,6.45 P1:C2.+ | 23.05,2.45 26.73,2.45 P1:U$1.3 | P1:R1.1 22.94,2.56 23.05,2.45
SG1:IN-
  Bottom 0.356: 31.8,50.47 SG1:U1.2 31.75,50.52 31.75,54.05 31.22,54.58 SG1:JP1.2
SG1:N$1
  Bottom 0.356: SG1:R2.3 33.26,54.91 35.3,56.95 35.3,58.45 | 35.3,58.45 35.3,58.8 | SG1:R1.1 35.3,58.92 35.3,58.45
SG1:N$2
  Bottom 0.356: SG1:R2.1 27.05,54.58 27.05,59.45 26.78,59.72 24.56,59.72 SG1:R3.2
SG1:N$3
  Bottom 0.356: SG1:U1.6 29.45,40.05 32.05,37.45 32.05,37.16 SG1:R4.2
SG1:N$5
  Bottom 0.356: SG1:U1.3 30.72,51.55 SG1:R2.2
SG1:N$6
  Bottom 0.356: 27.24,42.33 SG1:U1.5 26.91,40.1 SG1:R5.1 27.24,37.21 SG1:R6.2
SG1:N$7
  Bottom 0.356: SG1:U1.1 35.55,51.3 35.55,55.2 36.9,56.55 36.9,57.49 SG1:R8.1
SG1:N$8
  Bottom 0.356: SG1:R7.3 42.13,50.28 44.55,52.7 44.55,54.56 SG1:R9.2 44.5,57.47 SG1:R8.2
SG1:N$9
  Bottom 0.356: 39.05,47.45 36.9,49.6 36.9,54.61 SG1:R9.1 | 39.05,47.45 40.59,47.45 SG1:R7.2 | SG1:U1.8 34.53,42.93 39.05,47.45
SG2:IN-
  Bottom 0.356: SG2:JP1.2 11.4,55.6 11.55,55.45 11.55,51.67 SG2:U1.2
SG2:N$1
  Bottom 0.356: SG2:R2.3 13.21,55.11 15.3,57.2 15.3,60.45 | 15.3,60.45 15.3,60.81 | SG2:R1.1 15.3,61.21 15.3,60.45
SG2:N$2
  Bottom 0.356: SG2:R3.2 8.13,53.63 SG2:R2.1
SG2:N$3
  Bottom 0.356: SG2:U1.6 10.4,40.1 12.05,38.45 15.91,38.45 SG2:R4.2
SG2:N$5
  Bottom 0.356: SG2:R2.2 10.67,50.55 SG2:U1.3
SG2:N$6
  Bottom 0.356: 7.86,42.05 SG2:U1.5 7.86,41.69 SG2:R5.1 5.99,39.72 SG2:R6.2
SG2:N$7
  Bottom 0.356: SG2:U1.1 15.48,55.45 | 15.48,55.45 15.48,55.53 | 15.48,55.45 16.93,56.9 SG2:R8.1
SG2:N$8
  Bottom 0.356: SG2:R7.3 24.57,52.02 24.57,54.52 SG2:R9.2 SG2:R8.2
SG2:N$9
  Bottom 0.356: 19.55,48.7 18.55,49.7 18.55,51.2 16.95,52.8 16.95,54.52 SG2:R9.1 | 19.55,48.7 20.8,47.45 22.54,47.45 SG2:R7.2 | SG2:U1.8 15.48,46.38 17.3,48.2 19.05,48.2 19.55,48.7